# Altium project Switcher.PrjPCB
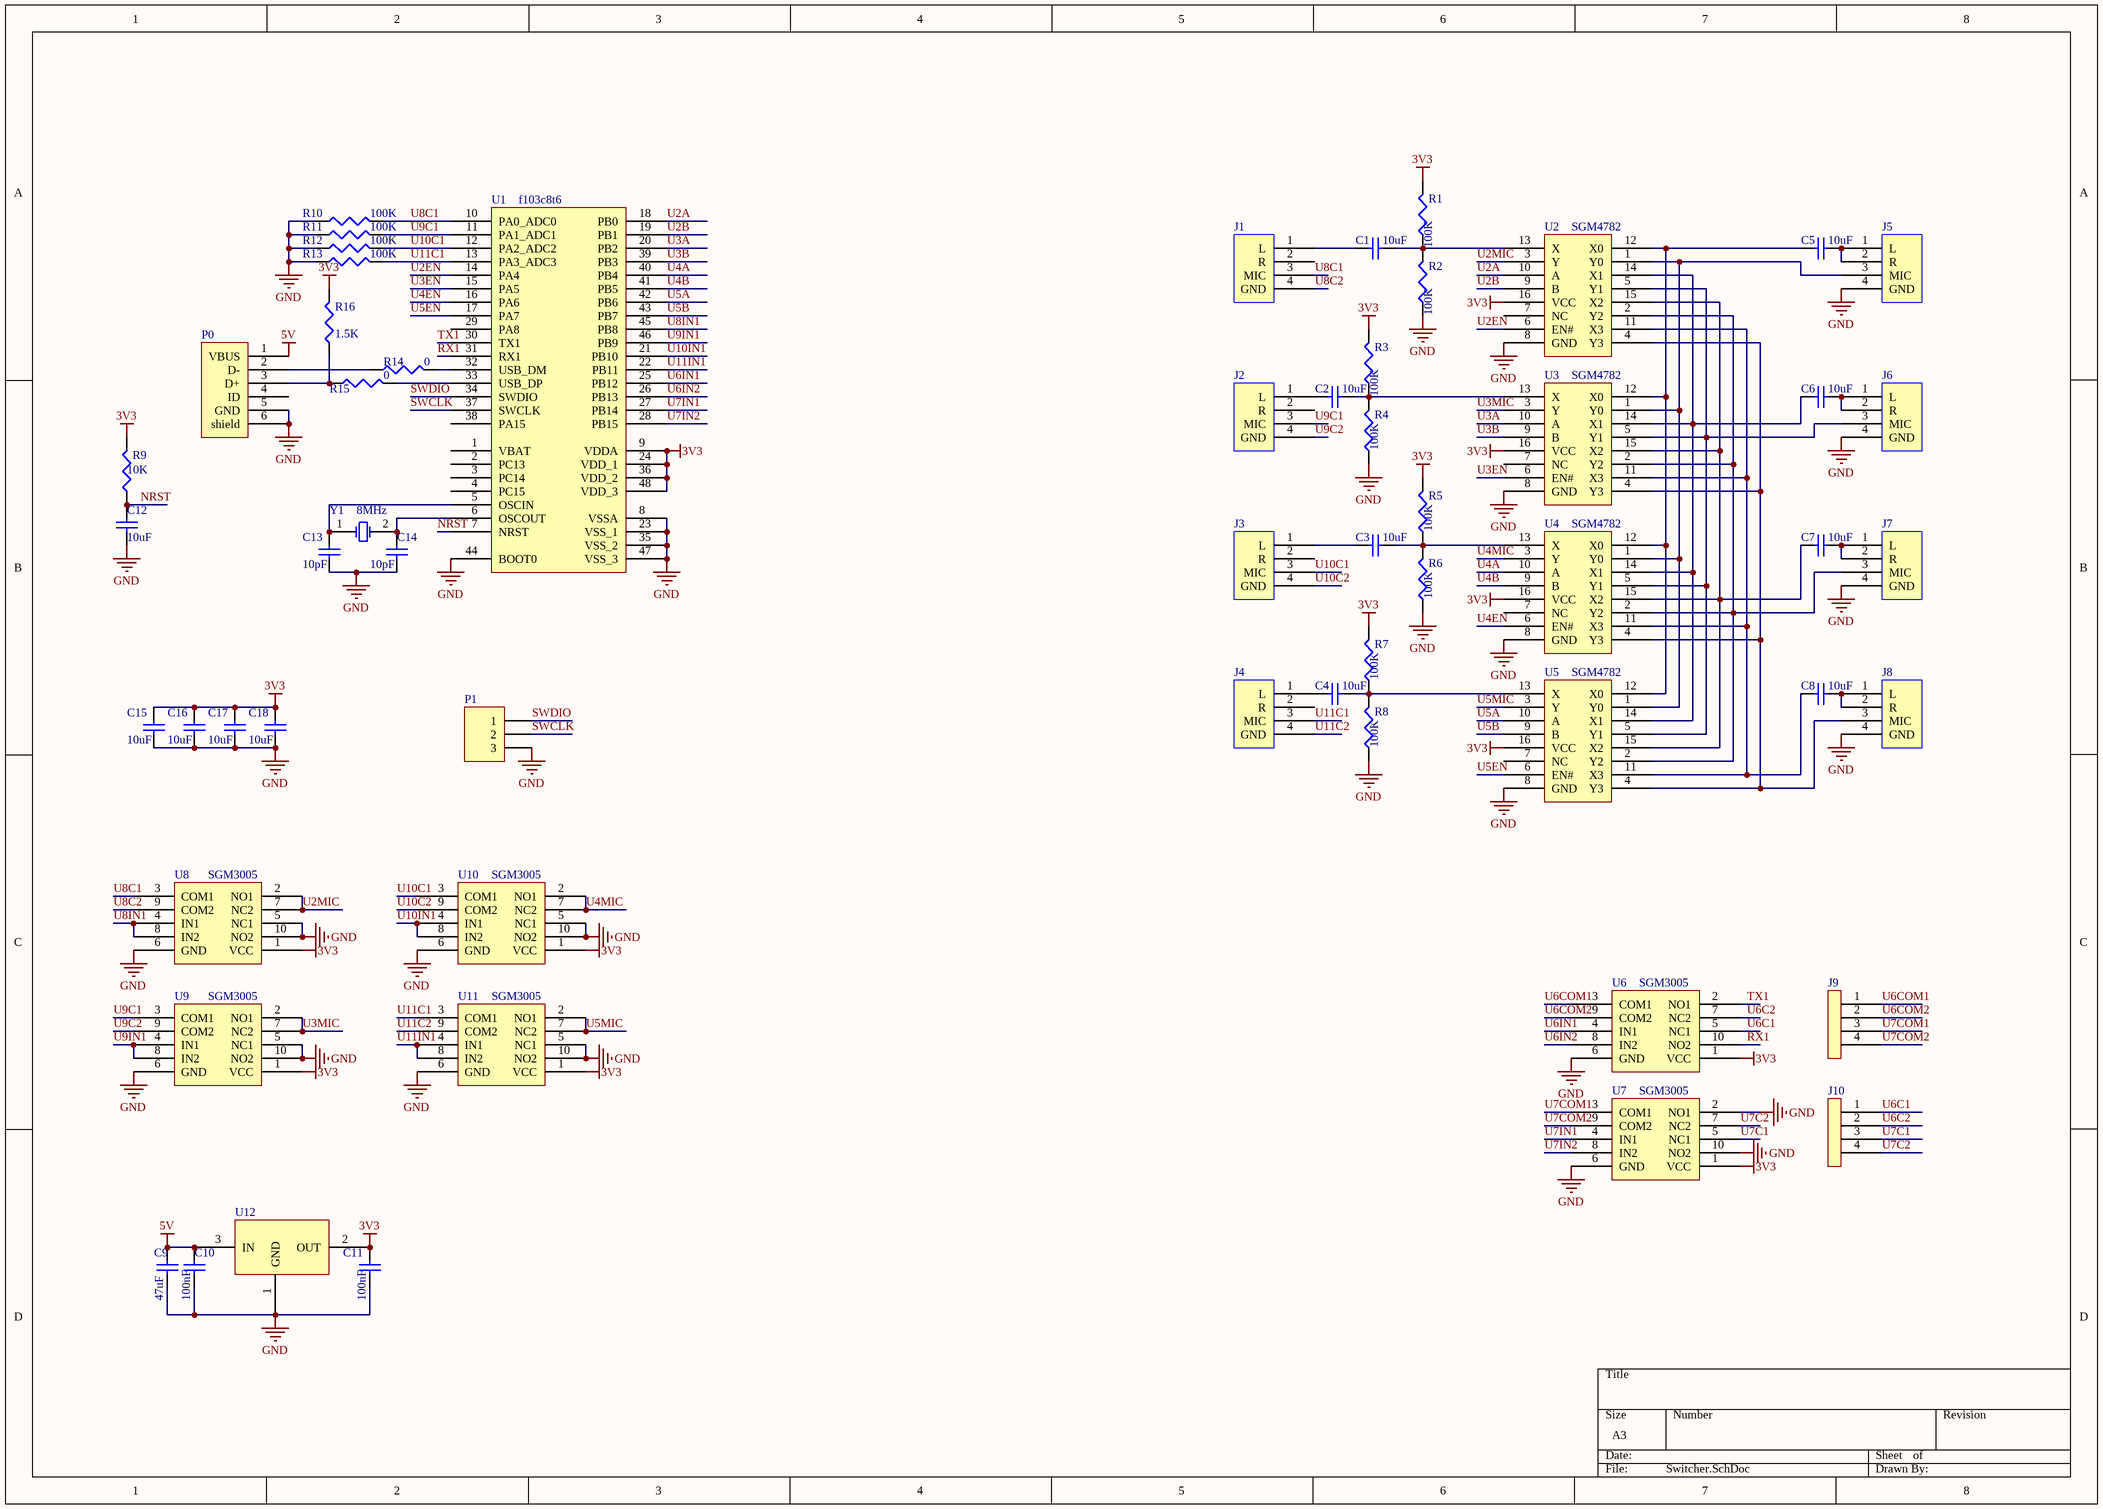
[diagram p0: Switcher.SchDoc]
1 sheet, 59 parts. Net scope: global (net labels, ports and power ports of the same name join across sheets).
Board files: Switcher.PcbDoc, size.PcbDoc

## Sheet Switcher.SchDoc
size A3

### Parts
C1  value 10uF  [1608(0603C)]
C2  value 10uF  [1608(0603C)]
C3  value 10uF  [1608(0603C)]
C4  value 10uF  [1608(0603C)]
C5  value 10uF  [1608(0603C)]
C6  value 10uF  [1608(0603C)]
C7  value 10uF  [1608(0603C)]
C8  value 10uF  [1608(0603C)]
C9  value 47uF  [1608(0603C)]
C10  value 100nF  [1608(0603C)]
C11  value 100nF  [1608(0603C)]
C12  value 10uF  [1608(0603C)]
C13  value 10pF  [1608(0603C)]
C14  value 10pF  [1608(0603C)]
C15  value 10uF  [1608(0603C)]
C16  value 10uF  [1608(0603C)]
C17  value 10uF  [1608(0603C)]
C18  value 10uF  [1608(0603C)]
J1  (no value)  [PJ-322]
J2  (no value)  [PJ-322]
J3  (no value)  [PJ-322]
J4  (no value)  [PJ-322]
J5  (no value)  [PJ-322]
J6  (no value)  [PJ-322]
J7  (no value)  [PJ-322]
J8  (no value)  [PJ-322]
J9  (no value)  [PJ-322]
J10  (no value)  [PJ-322]
P0  (no value)  [USB_MICRO]
P1  (no value)  [SIP3]
R1  value 100K  [1608(0603R)]
R2  value 100K  [1608(0603R)]
R3  value 100K  [1608(0603R)]
R4  value 100K  [1608(0603R)]
R5  value 100K  [1608(0603R)]
R6  value 100K  [1608(0603R)]
R7  value 100K  [1608(0603R)]
R8  value 100K  [1608(0603R)]
R9  value 10K  [1608(0603R)]
R10  value 100K  [1608(0603R)]
R11  value 100K  [1608(0603R)]
R12  value 100K  [1608(0603R)]
R13  value 100K  [1608(0603R)]
R14  value 0  [1608(0603R)]
R15  value 0  [1608(0603R)]
R16  value 1.5K  [1608(0603R)]
U1  f103c8t6  [LQFP48]
U2  SGM4782  [TSSOP-16]
U3  SGM4782  [TSSOP-16]
U4  SGM4782  [TSSOP-16]
U5  SGM4782  [TSSOP-16]
U6  SGM3005  [MSOP-10]
U7  SGM3005  [MSOP-10]
U8  SGM3005  [MSOP-10]
U9  SGM3005  [MSOP-10]
U10  SGM3005  [MSOP-10]
U11  SGM3005  [MSOP-10]
U12  (no value)  [SOT-223]
Y1  8MHz  [XTAL1]

### Nets
3V3: C11.2 C15.2 C16.2 C17.2 C18.2 R1.2 R3.2 R5.2 R7.2 R9.2 R16.2 U1.9(VDDA) U1.24(VDD_1) U1.36(VDD_2) U1.48(VDD_3) U2.16(VCC) U3.16(VCC) U4.16(VCC) U5.16(VCC) U6.1(VCC) U7.1(VCC) U8.1(VCC) U9.1(VCC) U10.1(VCC) U11.1(VCC) U12.2(OUT)
5V: C9.2 C10.2 P0.1(VBUS) U12.3(IN)
GND: C9.1 C10.1 C11.1 C12.1 C13.1 C14.1 C15.1 C16.1 C17.1 C18.1 J5.4(GND) J6.4(GND) J7.4(GND) J8.4(GND) P0.5(GND) P0.6(shield) P1.3 R2.1 R4.1 R6.1 R8.1 R10.1 R11.1 R12.1 R13.1 U1.8(VSSA) U1.23(VSS_1) U1.35(VSS_2) U1.44(BOOT0) U1.47(VSS_3) U2.8(GND) U3.8(GND) U4.8(GND) U5.8(GND) U6.6(GND) U7.2(NO1) U7.6(GND) U7.10(NO2) U8.5(NC1) U8.6(GND) U8.10(NO2) U9.5(NC1) U9.6(GND) U9.10(NO2) U10.5(NC1) U10.6(GND) U10.10(NO2) U11.5(NC1) U11.6(GND) U11.10(NO2) U12.1(GND)
NRST: C12.2 R9.1 U1.7(NRST)
RX1: U1.31(RX1) U6.10(NO2)
SWCLK: P1.2 U1.37(SWCLK)
SWDIO: P1.1 U1.34(SWDIO)
TX1: U1.30(TX1) U6.2(NO1)
U2A: U1.18(PB0) U2.10(A)
U2B: U1.19(PB1) U2.9(B)
U2EN: U1.14(PA4) U2.6(EN#)
U2MIC: U2.3(Y) U8.2(NO1) U8.7(NC2)
U3A: U1.20(PB2) U3.10(A)
U3B: U1.39(PB3) U3.9(B)
U3EN: U1.15(PA5) U3.6(EN#)
U3MIC: U3.3(Y) U9.2(NO1) U9.7(NC2)
U4A: U1.40(PB4) U4.10(A)
U4B: U1.41(PB5) U4.9(B)
U4EN: U1.16(PA6) U4.6(EN#)
U4MIC: U4.3(Y) U10.2(NO1) U10.7(NC2)
U5A: U1.42(PB6) U5.10(A)
U5B: U1.43(PB7) U5.9(B)
U5EN: U1.17(PA7) U5.6(EN#)
U5MIC: U5.3(Y) U11.2(NO1) U11.7(NC2)
U6C1: J10.1 U6.5(NC1)
U6C2: J10.2 U6.7(NC2)
U6COM1: J9.1 U6.3(COM1)
U6COM2: J9.2 U6.9(COM2)
U6IN1: U1.25(PB12) U6.4(IN1)
U6IN2: U1.26(PB13) U6.8(IN2)
U7C1: J10.3 U7.5(NC1)
U7C2: J10.4 U7.7(NC2)
U7COM1: J9.3 U7.3(COM1)
U7COM2: J9.4 U7.9(COM2)
U7IN1: U1.27(PB14) U7.4(IN1)
U7IN2: U1.28(PB15) U7.8(IN2)
U8C1: J1.3(MIC) R10.2 U1.10(PA0_ADC0) U8.3(COM1)
U8C2: J1.4(GND) U8.9(COM2)
U8IN1: U1.45(PB8) U8.4(IN1) U8.8(IN2)
U9C1: J2.3(MIC) R11.2 U1.11(PA1_ADC1) U9.3(COM1)
U9C2: J2.4(GND) U9.9(COM2)
U9IN1: U1.46(PB9) U9.4(IN1) U9.8(IN2)
U10C1: J3.3(MIC) R12.2 U1.12(PA2_ADC2) U10.3(COM1)
U10C2: J3.4(GND) U10.9(COM2)
U10IN1: U1.21(PB10) U10.4(IN1) U10.8(IN2)
U11C1: J4.3(MIC) R13.2 U1.13(PA3_ADC3) U11.3(COM1)
U11C2: J4.4(GND) U11.9(COM2)
U11IN1: U1.22(PB11) U11.4(IN1) U11.8(IN2)
NetC1_1: C1.1 J1.1(L)
NetC1_2: C1.2 R1.1 R2.2 U2.13(X)
NetC2_1: C2.1 J2.1(L)
NetC2_2: C2.2 R3.1 R4.2 U3.13(X)
NetC3_1: C3.1 J3.1(L)
NetC3_2: C3.2 R5.1 R6.2 U4.13(X)
NetC4_1: C4.1 J4.1(L)
NetC4_2: C4.2 R7.1 R8.2 U5.13(X)
NetC5_1: C5.1 U2.12(X0) U3.12(X0) U4.12(X0) U5.12(X0)
NetC5_2: C5.2 J5.1(L) J5.2(R)
NetC6_1: C6.1 U2.14(X1) U3.14(X1) U4.14(X1) U5.14(X1)
NetC6_2: C6.2 J6.1(L) J6.2(R)
NetC7_1: C7.1 U2.15(X2) U3.15(X2) U4.15(X2) U5.15(X2)
NetC7_2: C7.2 J7.1(L) J7.2(R)
NetC8_1: C8.1 U2.11(X3) U3.11(X3) U4.11(X3) U5.11(X3)
NetC8_2: C8.2 J8.1(L) J8.2(R)
NetC13_2: C13.2 U1.5(OSCIN) Y1.1(OSC1)
NetC14_2: C14.2 U1.6(OSCOUT) Y1.2(OSC2)
NetJ5_3: J5.3(MIC) U2.1(Y0) U3.1(Y0) U4.1(Y0) U5.1(Y0)
NetJ6_3: J6.3(MIC) U2.5(Y1) U3.5(Y1) U4.5(Y1) U5.5(Y1)
NetJ7_3: J7.3(MIC) U2.2(Y2) U3.2(Y2) U4.2(Y2) U5.2(Y2)
NetJ8_3: J8.3(MIC) U2.4(Y3) U3.4(Y3) U4.4(Y3) U5.4(Y3)
NetP0_2: P0.2(D-) R14.1
NetP0_3: P0.3(D+) R15.1 R16.1
NetR14_2: R14.2 U1.32(USB_DM)
NetR15_2: R15.2 U1.33(USB_DP)

Not connected (* = marked no-connect by the designer): J1 2(R); J2 2(R); J3 2(R); J4 2(R); P0 4(ID); U1 1(VBAT) 2(PC13) 3(PC14) 4(PC15) 29(PA8) 38(PA15); U2 7(NC); U3 7(NC); U4 7(NC); U5 7(NC)

### Library data of the parts
C1-C18 = Cap: Capacitor; Published: 8-Jun-2000; LatestRevisionDate: 17-Jul-2002; LatestRevisionNote: Re-released for DXP Platform.; PackageReference: RAD-0.3; Publisher: Altium Limited; PackageDescription: Radial Cap, Thru-Hole; 2 Leads; 0.3 in Pin Spacing
J1-J4 J6-J8 = seg-4
J5 = seg-4: OMTP
J9 J10 = CON4
P0 = micro_usb
P1 = Header 3: Header, 3-Pin; LatestRevisionDate: 17-Jul-2002; LatestRevisionNote: Re-released for DXP Platform.; Publisher: Altium Limited
R1-R16 = Res3: Resistor; Published: 8-Jun-2000; LatestRevisionDate: 29-May-2009; LatestRevisionNote: IPC-7351 Footprint Added.; PackageReference: J1-0603; Publisher: Altium Limited; PackageDescription: Chip Resistor
U12 = ASM1117-3.3
Y1 = XTAL: Crystal Oscillator; Published: 8-Jun-2000; LatestRevisionDate: 17-Jul-2002; LatestRevisionNote: Re-released for DXP Platform.; PackageReference: R38; Publisher: Altium Limited; PackageDescription: Crystal, Thru-Hole; 2 Leads; Body 3.1 x 8.2 mm (Dia.xH)